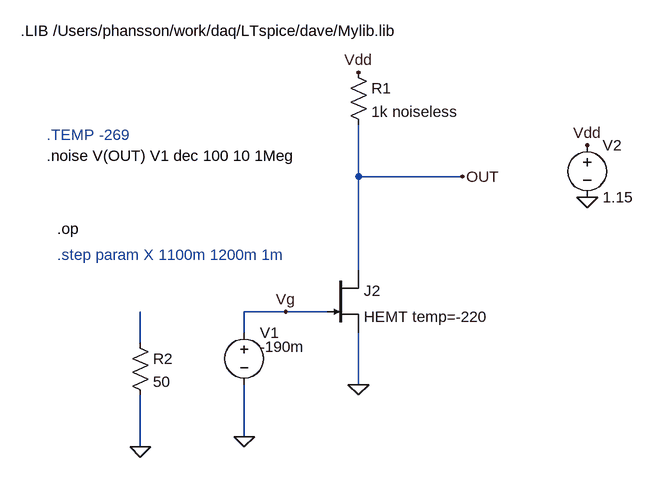
[diagram p0: schematic hemt-noise-4K.asc]
hemt-noise-4K.asc, the LTspice schematic file:
Version 4
SHEET 1 1480 872
WIRE 224 192 224 112
WIRE 384 192 224 192
WIRE 224 336 224 192
WIRE 112 400 48 400
WIRE 176 400 112 400
WIRE 48 432 48 400
WIRE -112 448 -112 400
WIRE 224 512 224 432
WIRE 48 592 48 512
WIRE -112 608 -112 528
FLAG 48 592 0
FLAG 224 512 0
FLAG 576 224 0
FLAG 576 144 Vdd
FLAG 112 400 Vg
FLAG 224 32 Vdd
FLAG 384 192 OUT
FLAG -112 608 0
SYMBOL voltage 48 416 R0
WINDOW 3 24 38 Left 2
SYMATTR Value -190m
SYMATTR InstName V1
SYMBOL njf 176 336 R0
SYMATTR InstName J2
SYMATTR Value HEMT temp=-220
SYMBOL voltage 576 128 R0
SYMATTR InstName V2
SYMATTR Value 1.15
SYMBOL res 208 16 R0
SYMATTR InstName R1
SYMATTR Value 1k noiseless
SYMBOL res -128 432 R0
SYMATTR InstName R2
SYMATTR Value 50
TEXT -296 -32 Left 2 !.LIB /Users/phansson/work/daq/LTspice/dave/Mylib.lib
TEXT -256 160 Left 2 !.noise V(OUT) V1 dec 100 10 1Meg
TEXT -256 128 Left 2 ;.TEMP -269
TEXT -240 272 Left 2 !.op
TEXT -240 312 Left 2 ;.step param X 1100m 1200m 1m

The netlist it stands for:
* hemt-noise-4K.asc
V1 Vg 0 -190m
J2 OUT Vg 0 HEMT temp=-220
V2 Vdd 0 1.15
R1 Vdd OUT 1k noiseless
R2 N001 0 50
.model NJF NJF
.model PJF PJF
.lib standard.jft
.LIB /Users/phansson/work/daq/LTspice/dave/Mylib.lib
.noise V(OUT) V1 dec 100 10 1Meg
* .TEMP -269
.op
* .step param X 1100m 1200m 1m
.backanno
.end